# Altium project ConstSegmentClock.PrjPcb
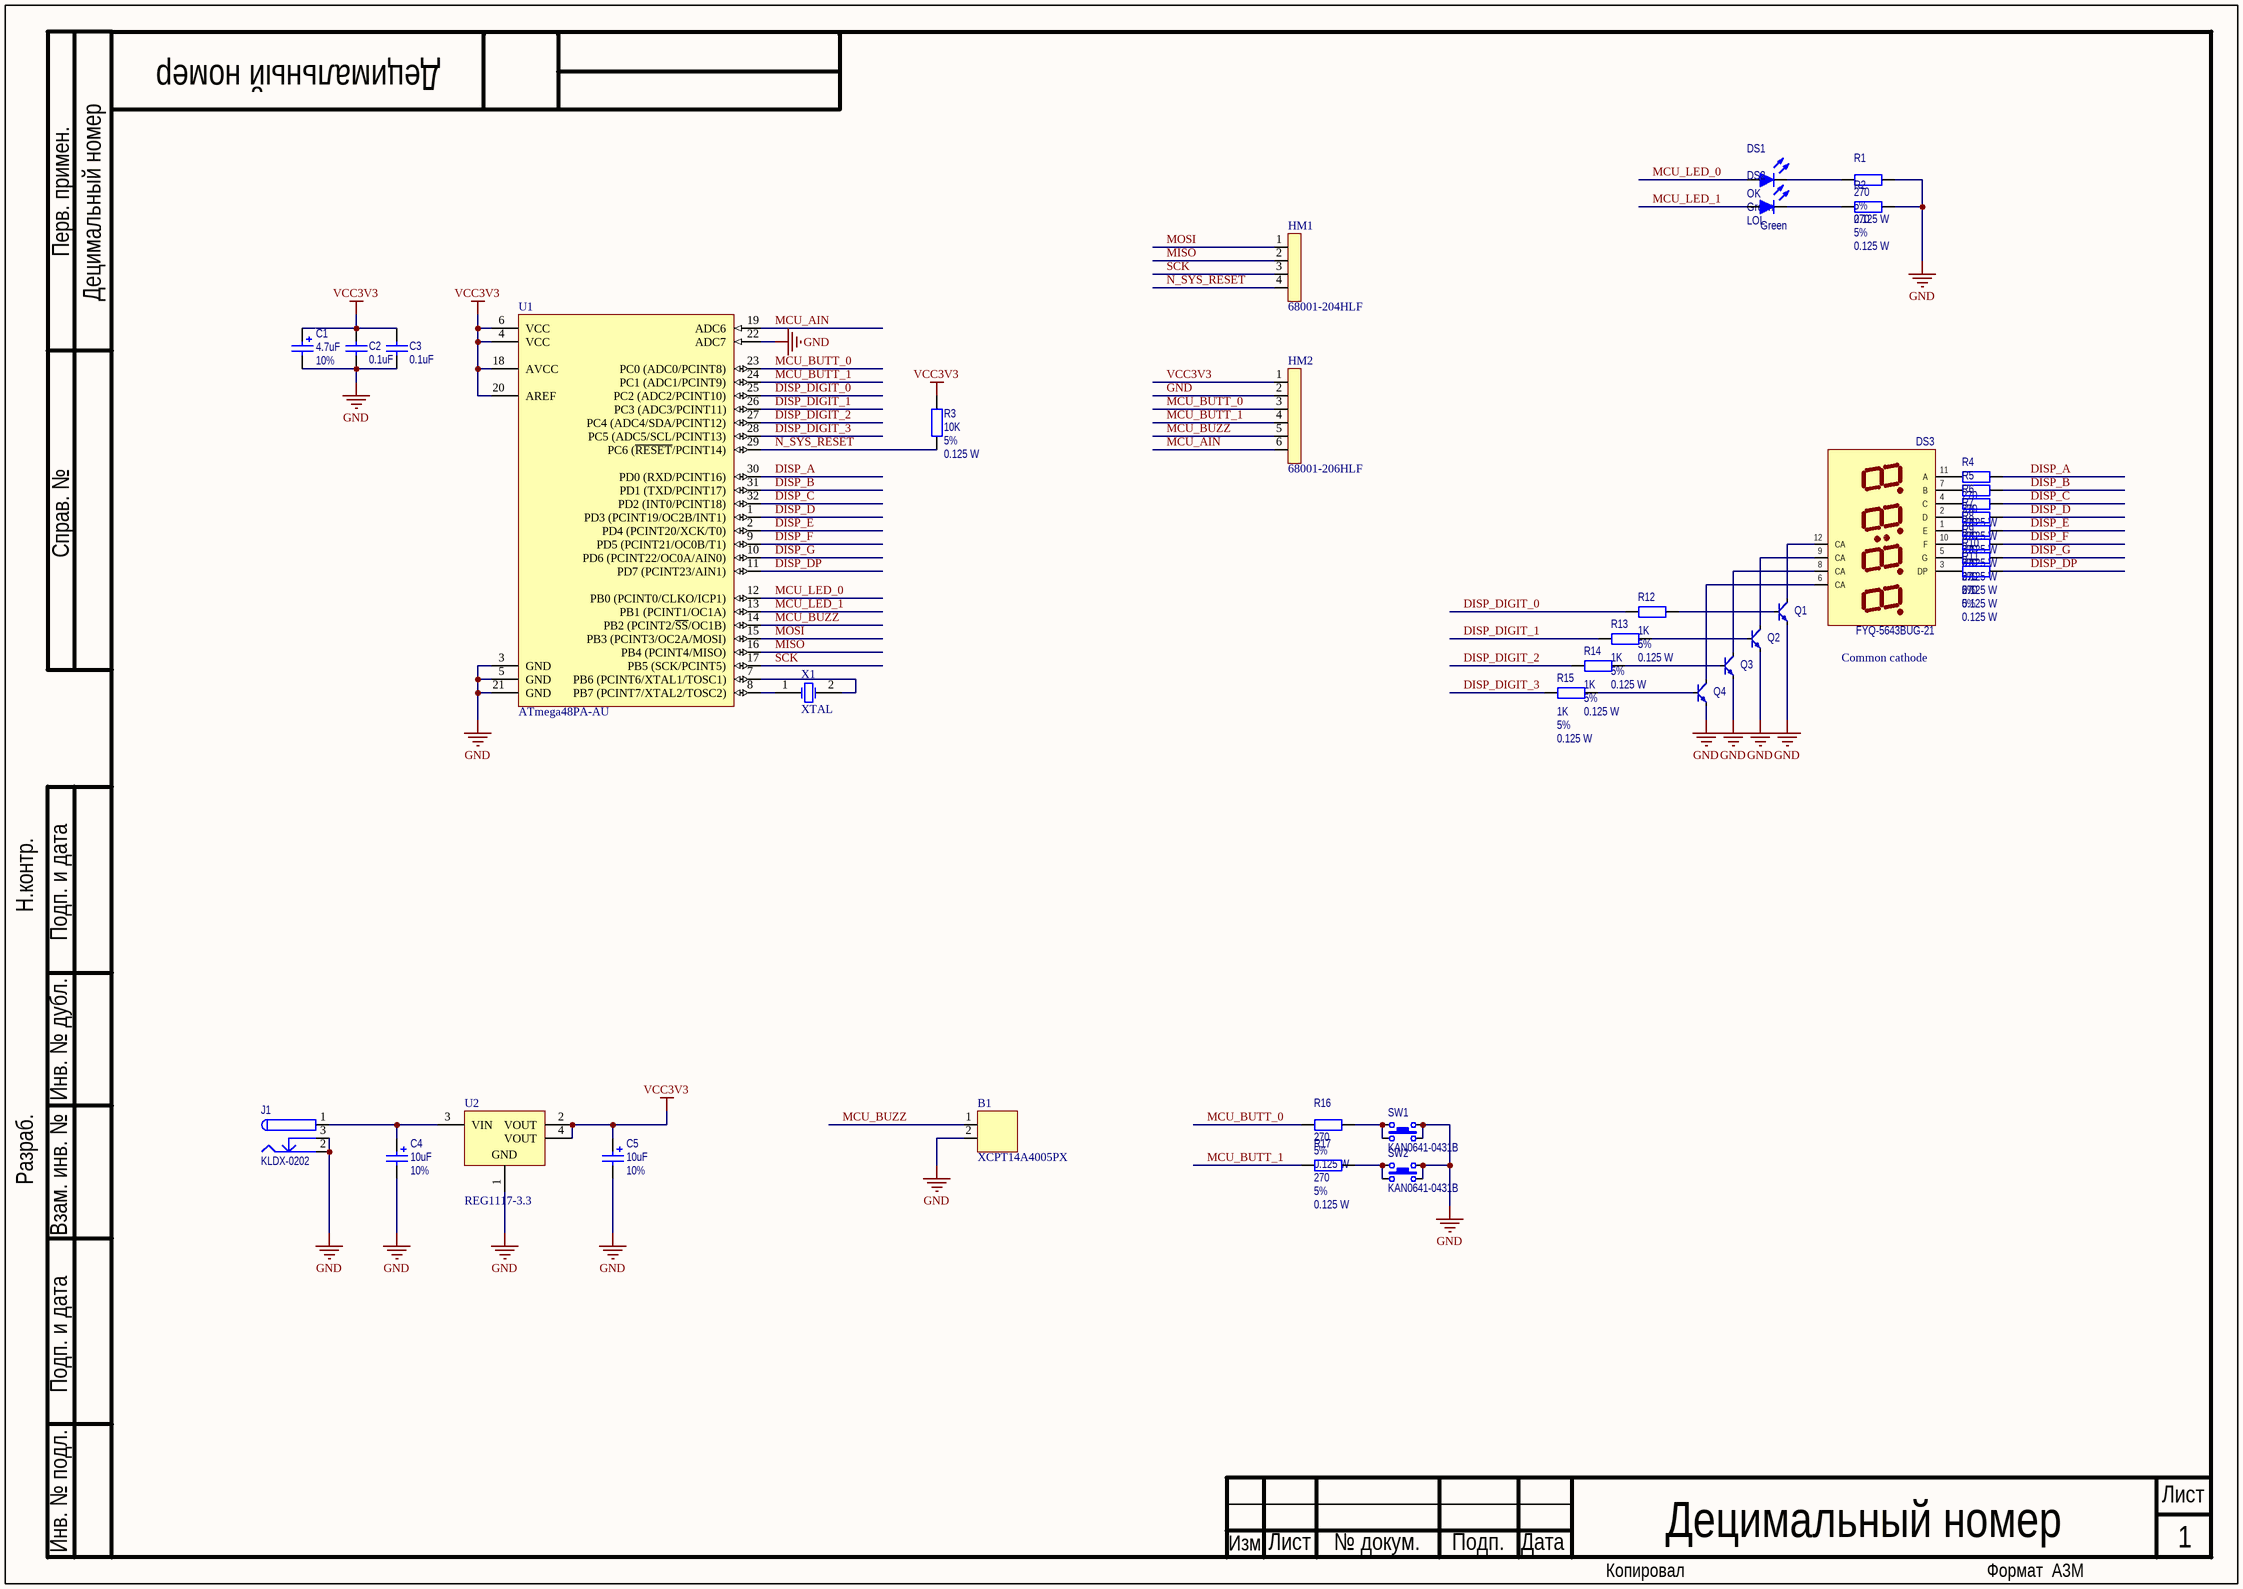
[diagram p0: MCU.SchDoc]
1 sheet, 38 parts. Net scope: global (net labels, ports and power ports of the same name join across sheets).
Board files: ConstSegmentClock - Logic.PcbDoc, ConstSegmentClock - Ext DC power.PcbDoc

## Sheet MCU.SchDoc: Наименование
size 420 x 297 mm; DocumentNumber: Децимальный номер; SheetNumber: 1; SheetTotal: 1; PageSetup: Record=PageOptions|CenterHorizontal=False|CenterVertical=False|PrintScale=0.95|XCorrection=0.00|YCorrection=0.00|PrintKind=1|BorderSize=5000000|LeftOffset=0|BottomOffset=0|Orientation=1|PaperLength=1000|PaperWidth=1000|Scale=100|PaperSource=15|PrintQuality=600|MediaType=1|DitherType=10|PaperKind=A4|PrintScaleMode=1; DocumentType: Схема электрическая принципиальная; Rule: PcbType=ProtelPcb

### Parts
B1  XCPT14A4005PX  [XCPT14A4005PX]
C1  4.7uF  Tolerance: 10%  [KEMET_A]
C2  0.1uF  [CAPC2012N]
C3  0.1uF  [CAPC2012N]
C4  10uF  Tolerance: 10%  [KEMET_A]
C5  10uF  Tolerance: 10%  [KEMET_A]
DS1  OK  value Green  [LED_1206]
DS2  LOL  value Green  [LED_1206]
DS3  FYQ-5643BUG-21  [FYQ-5643BUG-21]
HM1  68001-204HLF  [HEADER-1X4]
HM2  68001-206HLF  [HEADER-1X6]
J1  KLDX-0202  [KLDX-0202]
Q1  BC817  [SOT23-3L]  (value not drawn)
Q2  BC817  [SOT23-3L]  (value not drawn)
Q3  BC817  [SOT23-3L]  (value not drawn)
Q4  BC817  [SOT23-3L]  (value not drawn)
R1  270  Tolerance: 5%  Power rating: 0.125 W  [RESC2012N]
R2  270  Tolerance: 5%  Power rating: 0.125 W  [RESC2012N]
R3  10K  Tolerance: 5%  Power rating: 0.125 W  [RESC2012N]
R4  270  Tolerance: 5%  Power rating: 0.125 W  [RESC2012N]
R5  270  Tolerance: 5%  Power rating: 0.125 W  [RESC2012N]
R6  270  Tolerance: 5%  Power rating: 0.125 W  [RESC2012N]
R7  270  Tolerance: 5%  Power rating: 0.125 W  [RESC2012N]
R8  270  Tolerance: 5%  Power rating: 0.125 W  [RESC2012N]
R9  270  Tolerance: 5%  Power rating: 0.125 W  [RESC2012N]
R10  270  Tolerance: 5%  Power rating: 0.125 W  [RESC2012N]
R11  270  Tolerance: 5%  Power rating: 0.125 W  [RESC2012N]
R12  1K  Tolerance: 5%  Power rating: 0.125 W  [RESC2012N]
R13  1K  Tolerance: 5%  Power rating: 0.125 W  [RESC2012N]
R14  1K  Tolerance: 5%  Power rating: 0.125 W  [RESC2012N]
R15  1K  Tolerance: 5%  Power rating: 0.125 W  [RESC2012N]
R16  270  Tolerance: 5%  Power rating: 0.125 W  [RESC2012N]
R17  270  Tolerance: 5%  Power rating: 0.125 W  [RESC2012N]
SW1  KAN0641-0431B  [KAN0641]
SW2  KAN0641-0431B  [KAN0641]
U1  ATmega48PA-AU  [32A_N]
U2  REG1117-3.3  [TI-DCY4_N]
X1  XTAL  [R38]

### Nets
GND: B1.2 C1.2 C2.1 C3.1 C4.2 C5.2 HM2.2 J1.2 J1.3 Q1.2 Q2.2 Q3.2 Q4.2 R1.2 R2.2 SW1.3 SW1.4 SW2.3 SW2.4 U1.3(GND) U1.5(GND) U1.21(GND) U1.22(ADC7) U2.1(GND)
VCC3V3: C1.1 C2.2 C3.2 C5.1 HM2.1 R3.1 U1.4(VCC) U1.6(VCC) U1.18(AVCC) U1.20(AREF) U2.2(VOUT) U2.4(VOUT)
DISP_A: R4.2 U1.30(PD0_(RXD/PCINT16))
DISP_B: R5.2 U1.31(PD1_(TXD/PCINT17))
DISP_C: R6.2 U1.32(PD2_(INT0/PCINT18))
DISP_D: R7.2 U1.1(PD3_(PCINT19/OC2B/INT1))
DISP_DIGIT_0: R12.1 U1.25(PC2_(ADC2/PCINT10))
DISP_DIGIT_1: R13.1 U1.26(PC3_(ADC3/PCINT11))
DISP_DIGIT_2: R14.1 U1.27(PC4_(ADC4/SDA/PCINT12))
DISP_DIGIT_3: R15.1 U1.28(PC5_(ADC5/SCL/PCINT13))
DISP_DP: R11.2 U1.11(PD7_(PCINT23/AIN1))
DISP_E: R8.2 U1.2(PD4_(PCINT20/XCK/T0))
DISP_F: R9.2 U1.9(PD5_(PCINT21/OC0B/T1))
DISP_G: R10.2 U1.10(PD6_(PCINT22/OC0A/AIN0))
MCU_AIN: HM2.6 U1.19(ADC6)
MCU_BUTT_0: HM2.3 R16.1 U1.23(PC0_(ADC0/PCINT8))
MCU_BUTT_1: HM2.4 R17.1 U1.24(PC1_(ADC1/PCINT9))
MCU_BUZZ: B1.1 HM2.5 U1.14(PB2_(PCINT2/~{SS}/OC1B))
MCU_LED_0: DS1.1(A) U1.12(PB0_(PCINT0/CLKO/ICP1))
MCU_LED_1: DS2.1(A) U1.13(PB1_(PCINT1/OC1A))
MISO: HM1.2 U1.16(PB4_(PCINT4/MISO))
MOSI: HM1.1 U1.15(PB3_(PCINT3/OC2A/MOSI))
N_SYS_RESET: HM1.4 R3.2 U1.29(PC6_(~{RESET}/PCINT14))
SCK: HM1.3 U1.17(PB5_(SCK/PCINT5))
NetC4_1: C4.1 J1.1 U2.3(VIN)
NetDS1_2: DS1.2(K) R1.1
NetDS2_2: DS2.2(K) R2.1
NetDS3_1: DS3.1(E) R8.1
NetDS3_2: DS3.2(D) R7.1
NetDS3_3: DS3.3(DP) R11.1
NetDS3_4: DS3.4(C) R6.1
NetDS3_5: DS3.5(G) R10.1
NetDS3_6: DS3.6(CA) Q4.3
NetDS3_7: DS3.7(B) R5.1
NetDS3_8: DS3.8(CA) Q3.3
NetDS3_9: DS3.9(CA) Q2.3
NetDS3_10: DS3.10(F) R9.1
NetDS3_11: DS3.11(A) R4.1
NetDS3_12: DS3.12(CA) Q1.3
NetQ1_1: Q1.1 R12.2
NetQ2_1: Q2.1 R13.2
NetQ3_1: Q3.1 R14.2
NetQ4_1: Q4.1 R15.2
NetR16_2: R16.2 SW1.1 SW1.2
NetR17_2: R17.2 SW2.1 SW2.2
NetU1_7: U1.7(PB6_(PCINT6/XTAL1/TOSC1)) X1.2(OSC2)
NetU1_8: U1.8(PB7_(PCINT7/XTAL2/TOSC2)) X1.1(OSC1)

### Notes on the sheet
- Common cathode
- Перв. примен.
- Справ. №
- Н.контр.
- Подп. и дата
- Инв. № дубл.
- Разраб.
- Взам. инв. №
- Инв. № подл.
- Лист
- Изм.
- № докум.
- Подп.
- Дата
- Копировал
- Формат  A3М
- (in symbol CGA4**X7R***********) Text
- (in symbol ERJ6GEYJ***V) Text
- (in symbol QTLP650C4TR) Text
- (in symbol T491A***K***AH) Text

### Library data of the parts
B1 = XCPT14A4005PX: Piezoelectric ceramic buzzer; Part Name: XCPT14A4005PX
C1 C4 C5 = T491A***K***AH: A size, STANDARD Tantalum Surface Mount Capacitors; Part Name: T491A***K***AH
  C1: Value: 4.7uF
  C4 C5: Value: 10uF
C2 C3 = CGA4**X7R***********: 0805 size MULTILAYER CERAMIC CHIP CAPACITOR, General (Up to 50V); Part Name: CGA4**X7R***********; Value: 0.1uF
DS1 DS2 = QTLP650C4TR: Green LED, STANDARD BRIGHT 1206; Manufacturer: Everlight Electronics Co Ltd; Part Name: QTLP650C4TR
DS3 = FYQ-5643BUG-21: Segment indicator; Part Name: FYQ-5643BUG-21
HM1 = 68001-204HLF: 1x4 PIN HEADER .100" SR STRAIGHT; Part Name: 68001-204HLF
HM2 = 68001-206HLF: 1x6 PIN HEADER .100" SR STRAIGHT; Part Name: 68001-206HLF
J1 = KLDX-0202: Low Voltage Power Supply Connector; Part Name: KLDX-0202
Q1-Q4 = BC817: 45 V, 500 mA NPN general-purpose transistors; Part Name: BC817
R1-R17 = ERJ6GEYJ***V: 0805 size, STANDARD thick Film Chip Resistor; Manufacturer: Panasonic; Part Name: ERJ6GEYJ***V
  R1 R2 R4-R11 R16 R17: Value: 270
  R3: Value: 10K
  R12-R15: Value: 1K
SW1 SW2 = KAN0641-0431B: Tact switch, button SMD; Part Name: KAN0641-0431B
U1 = ATmega48PA-AU: 8-bit AVR Microcontroller, 4KB Flash, 256 Bytes EEPROM, 512 Bytes SRAM, 32-pin TQFP, Industrial Grade (-40°C to 85°C); Published: 1-Apr-2010; DatasheetVersion: revA, Jan-2010; PackageVersion: revB, Oct-2001; PackageReference: 32A; Publisher: Altium Limited; PackageDescription: 32-Lead, 7x7x1.0 mm Body, 0.8mm Lead Pitch, Thin Profile Plastic Quad Flat Package (TQFP); Supplier 1: Digi-Key; Supplier Part Number 1: ATMEGA48PA-AU-ND; Supplier 2: Farnell; Supplier Part Number 2: 1715488; Supplier 3: Mouser; Supplier Part Number 3: 556-ATMEGA48PA-AU; Code_JEDEC: MS-026-ABA; ComponentLink1Description: Manufacturer Link; ComponentLink1URL: http://www.atmel.com/products/avr/default.asp?; ComponentLink2Description: ATmega48A/48PA/88A/88PA/168A/168PA/328/328P Datasheet; ComponentLink2URL: http://www.atmel.com/dyn/resources/prod_documents/8271.pdf; ComponentLink3Description: ATmega48A/48PA/88A/88PA/168A/168PA/328/328P Summary; ComponentLink3URL: http://www.atmel.com/dyn/resources/prod_documents/8271S.pdf; ComponentLink4Description: Atmel.com Home; ComponentLink4URL: http://www.atmel.com
X1 = XTAL: Crystal Oscillator; Published: 8-Jun-2000; LatestRevisionDate: 17-Jul-2002; LatestRevisionNote: Re-released for DXP Platform.; PackageReference: R38; Publisher: Altium Limited; PackageDescription: Crystal, Thru-Hole; 2 Leads; Body 3.1 x 8.2 mm (Dia.xH)